# Altium schematic sheet 05-Power.SchDoc: Power supplies
size A3; Date: 01/01/2016; Author: Frédéric Renet; Organization: APTUSTECH; Address2: 8 Rue Esperandieu; Address3: 13004 Marseille; Address4: FRANCE; DocumentNumber: 123; Revision: 1.0; SheetNumber: 6; SheetTotal: 6
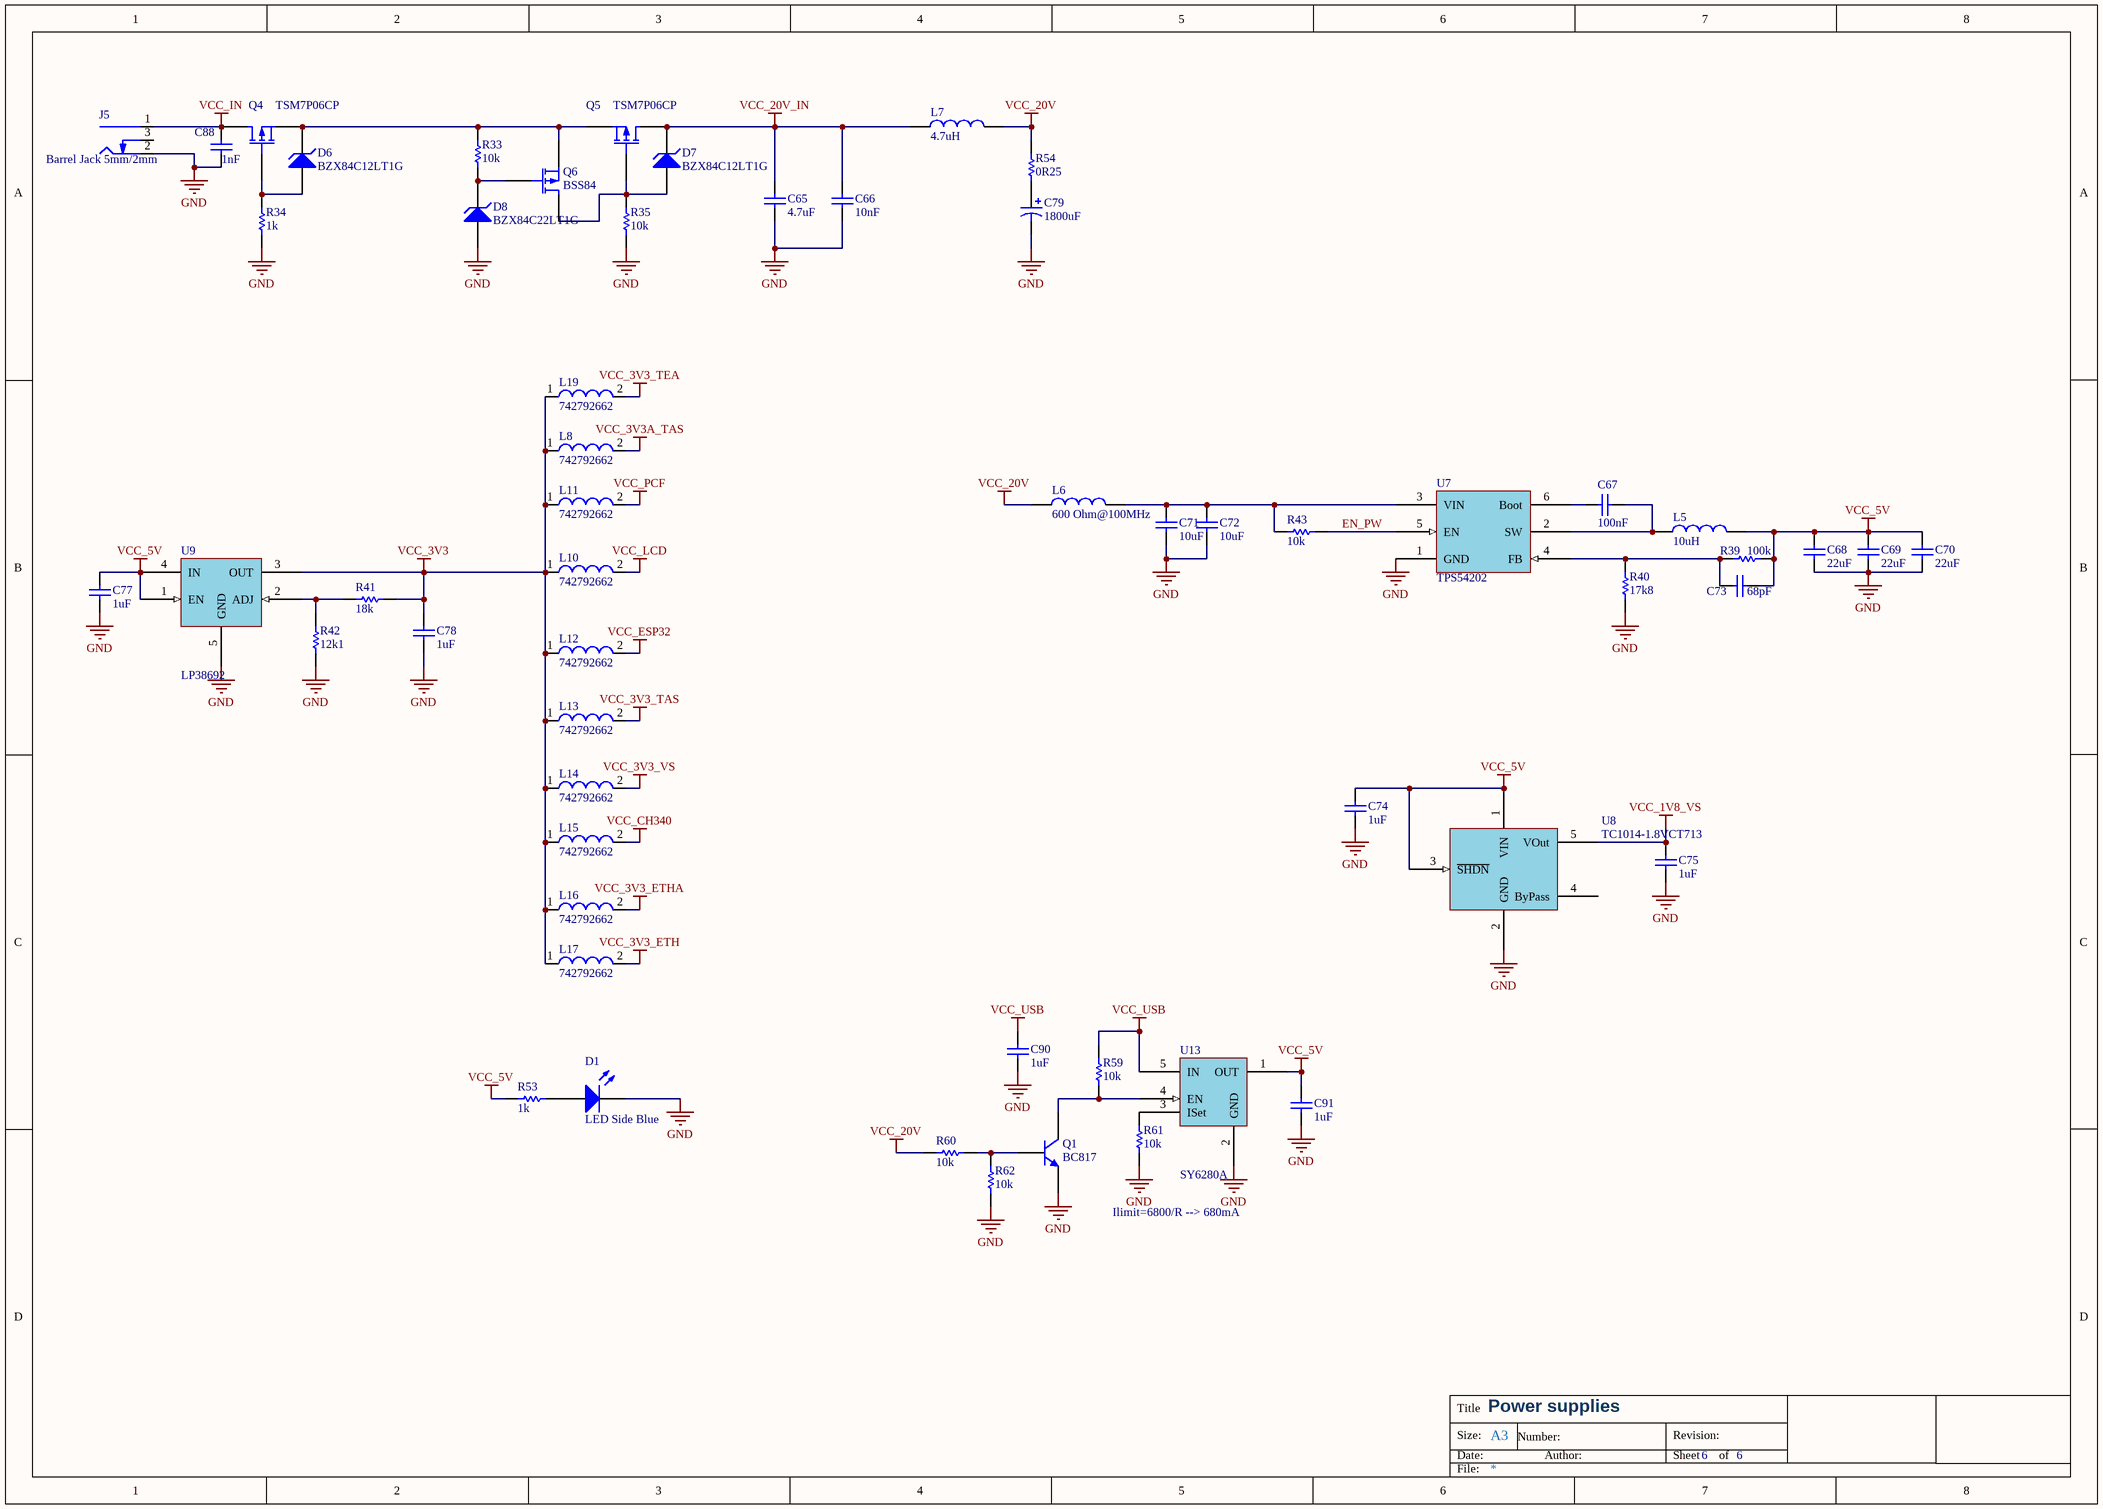
[diagram p0: 05-Power.SchDoc]

## Parts
C65  value 4.7uF  [CAPC3216X16N]  (hidden comment: 4.7uF 50V 1206 X5R)
C66  value 10nF  [CAPC1608X06N]  (hidden comment: 10nF 50V 0603 NP0)
C67  value 100nF  [CAPC2012X14N]  (hidden comment: 100nfF 10V 0805 X5R)
C68  value 22uF  [CAPC2012X14N]  (hidden comment: 22uF 10V 0805 X5R)
C69  value 22uF  [CAPC2012X14N]  (hidden comment: 22uF 10V 0805 X5R)
C70  value 22uF  [CAPC2012X14N]  (hidden comment: 22uF 10V 0805 X5R)
C71  value 10uF  [CAPC3216X16N]  (hidden comment: 10uF 50V 1206 X5R)
C72  value 10uF  [CAPC3216X16N]  (hidden comment: 10uF 50V 1206 X5R)
C73  value 68pF  [CAPC1608X06N]  (hidden comment: 68pF 50V 0603 NP0)
C74  value 1uF  [CAPC1608X06N]  (hidden comment: 1uF 16V 0603 X7R)
C75  value 1uF  [CAPC1608X06N]  (hidden comment: 1uF 16V 0603 X7R)
C77  value 1uF  [CAPC1608X06N]  (hidden comment: 1uF 16V 0603 X7R)
C78  value 1uF  [CAPC1608X06N]  (hidden comment: 1uF 16V 0603 X7R)
C79  value 1800uF  [Cap_POL_12.5mm_20mm_TH]  (hidden comment: 1800uF 25V)
C88  value 1nF  [CAPC3216X16N]  (hidden comment: 1nF 100V 1206 X7R)
C90  value 1uF  [CAPC1608X06N]  (hidden comment: 1uF 16V 0603 X7R)
C91  value 1uF  [CAPC1608X06N]  (hidden comment: 1uF 16V 0603 X7R)
D1  LED Side Blue  [APA1606]
D6  BZX84C12LT1G  [SOT95P230X110-3N]
D7  BZX84C12LT1G  [SOT95P230X110-3N]
D8  BZX84C22LT1G  [SOT95P230X110-3N]
J5  Barrel Jack 5mm/2mm  [CUI PJ-102AH]
L5  value 10uH  [SRN6045]  (hidden comment: SRN6045-100M)
L6  value 600 Ohm@100MHz  [IND2012X14N]  (hidden comment: 74279220601)
L7  value 4.7uH  [1255AY]  (hidden comment: 1255AY-4R7M=P3)
L8  742792662  [CAPC0603(1608)]
L10  742792662  [CAPC0603(1608)]
L11  742792662  [CAPC0603(1608)]
L12  742792662  [CAPC0603(1608)]
L13  742792662  [CAPC0603(1608)]
L14  742792662  [CAPC0603(1608)]
L15  742792662  [CAPC0603(1608)]
L16  742792662  [CAPC0603(1608)]
L17  742792662  [CAPC0603(1608)]
L19  742792662  [CAPC0603(1608)]
Q1  BC817  [SOT95P230X110-3N]
Q4  TSM7P06CP  [TO252]
Q5  TSM7P06CP  [TO252]
Q6  BSS84  [SOT95P230X110-3N]
R33  value 10k  [RESC1608X06N]  (hidden comment: 10k_0603)
R34  value 1k  [RESC1608X06N]  (hidden comment: 1k_0603)
R35  value 10k  [RESC1608X06N]  (hidden comment: 10k_0603)
R39  value 100k  [RESC1608X06N]  (hidden comment: 100k_0603)
R40  value 17k8  [RESC1608X06N]  (hidden comment: 17k8_0603)
R41  value 18k  [RESC1608X06N]  (hidden comment: 18k_0603)
R42  value 12k1  [RESC1608X06N]  (hidden comment: 12k1_0603)
R43  value 10k  [RESC1608X06N]  (hidden comment: 10k_0603)
R53  value 1k  [RESC1608X06N]  (hidden comment: 1k_0603)
R54  value 0R25  [RESC3116X07N]  (hidden comment: 0R25_1206)
R59  value 10k  [RESC1608X06N]  (hidden comment: 10k_0603)
R60  value 10k  [RESC1608X06N]  (hidden comment: 10k_0603)
R61  value 10k  [RESC1608X06N]  (hidden comment: 10k_0603)
R62  value 10k  [RESC1608X06N]  (hidden comment: 10k_0603)
U7  TPS54202  [SOT95P245X110-6N]
U8  TC1014-1.8VCT713  [SOT95P245X110-5N]
U9  LP38692  [SOT150P700X180-5N]
U13  SY6280A  [SOT95P245X110-5N]

## Nets
GND: C65.1 C66.1 C68.1 C69.1 C70.1 C71.1 C72.1 C74.1 C75.1 C77.1 C78.1 C79.2 C88.1 C90.1 C91.1 D1.1(K) D8.1(A) J5.2(Outer) Q1.2(E) R34.1 R35.1 R40.1 R42.1 R61.1 R62.2 U7.1(GND) U8.2(GND) U9.5(GND) U13.2(GND)
VCC_1V8_VS: C75.2 U8.5(VOut)
VCC_3V3: C78.2 L8.1 L10.1 L11.1 L12.1 L13.1 L14.1 L15.1 L16.1 L17.1 L19.1 R41.2 U9.3(OUT)
VCC_3V3_ETH: L17.2
VCC_3V3_ETHA: L16.2
VCC_3V3_TAS: L13.2
VCC_3V3_TEA: L19.2
VCC_3V3_VS: L14.2
VCC_3V3A_TAS: L8.2
VCC_5V: C68.2 C69.2 C70.2 C73.2 C74.2 C77.2 C91.2 L5.2 R39.2 R53.2 U8.1(VIN) U8.3(~{SHDN}) U9.1(EN) U9.4(IN) U13.1(OUT)
VCC_20V: L6.1 L7.2 R54.2 R60.2
VCC_20V_IN: C65.2 C66.2 D7.3(K) L7.1 Q5.2(D)
VCC_CH340: L15.2
VCC_ESP32: L12.2
VCC_IN: C88.2 J5.1(Centre) Q4.2(D)
VCC_LCD: L10.2
VCC_PCF: L11.2
VCC_USB: C90.2 R59.2 U13.5(IN)
EN_PW: R43.1 U7.5(EN)
NetC67_1: C67.1 U7.6(Boot)
NetC67_2: C67.2 L5.1 U7.2(SW)
NetC71_2: C71.2 C72.2 L6.2 R43.2 U7.3(VIN)
NetC73_1: C73.1 R39.1 R40.2 U7.4(FB)
NetC79_1: C79.1 R54.1
NetD1_2: D1.2(A) R53.1
NetD6_1: D6.1(A) Q4.1(G) R34.2
NetD6_3: D6.3(K) Q4.3(S) Q5.3(S) Q6.2(S) R33.2
NetD7_1: D7.1(A) Q5.1(G) Q6.3(D) R35.2
NetD8_3: D8.3(K) Q6.1(G) R33.1
NetQ1_1: Q1.1(B) R60.1 R62.1
NetQ1_3: Q1.3(C) R59.1 U13.4(EN)
NetR41_1: R41.1 R42.2 U9.2(ADJ)
NetR61_2: R61.2 U13.3(ISet)

Not connected (* = marked no-connect by the designer): J5 3(SW); U8 4(ByPass)

## Notes on the sheet
- Ilimit=6800/R --> 680mA
- Title
- Size:
- Date:
- A3
- Number:
- Author:
- Revision:
- Sheet
- of
- File:

## Library data of the parts
C65 = 4.7uF 50V 1206 X5R: Tolerance: 10%; Voltage: 50V; Supplier1: Digikey; Supplier2: Mouser; Supplier3: Farnell; RefSupplier1: 587-2994-1-ND; RefSupplier2: *; RefSupplier3: *; Case: 1206; Material: X5R
C66 = 10nF 50V 0603 NP0: Tolerance: 10%; Voltage: 50V; Supplier1: Digikey; Supplier2: Mouser; Supplier3: Farnell; RefSupplier1: 490-9666-1-ND; RefSupplier2: *; RefSupplier3: *; Case: 0603; Material: NP0
C67 = 100nF 50V 0805 X5R_1: 100nF 50V 0805 X5R; Tolerance: 10%; Voltage: 50V; Supplier1: Digikey; Supplier2: Mouser; Supplier3: Farnell; RefSupplier2: *; RefSupplier3: *; Case: 0805; Material: X5R
C68-C70 = 22uF 10V 0805 X5R: Tolerance: 10%; Voltage: 10V; Supplier1: Digikey; Supplier2: Mouser; Supplier3: Farnell; RefSupplier1: 490-10511-1-ND; RefSupplier2: *; RefSupplier3: *; Case: 0805; Material: X5R
C71 C72 = 10uF 50V 1206 X5R: Tolerance: 10%; Voltage: 50V; Supplier1: Digikey; Supplier2: Mouser; Supplier3: Farnell; RefSupplier1: 1276-6736-1-ND; RefSupplier2: *; RefSupplier3: *; Case: 1206; Material: X5R
C73 = 68pF 50V 0603 NP0: Tolerance: 10%; Voltage: 50V; Supplier1: Digikey; Supplier2: Mouser; Supplier3: Farnell; RefSupplier1: 490-11301-1-ND; RefSupplier2: *; RefSupplier3: *; Case: 0603; Material: NP0
C74 C75 C77 C78 C90 C91 = 1uF 16V 0603 X7R: Tolerance: 10%; Voltage: 16V; Supplier1: Digikey; Supplier2: Mouser; Supplier3: Farnell; RefSupplier1: EMK107B7105KA-T; RefSupplier2: *; RefSupplier3: *; Case: 0603; Material: X7R
C79 = 1800uF 25V 12.5mm 20mm: Aluminum Capacitor 1800uF 25V TH 12.5mm 20mm; PartNumber: EGXF250ELL182MK20S; Manufacturer: United Chemi-Con; Tolerance: 20%; Voltage: 25V; Supplier1: Mouser; RefSupplier1: 661-EGXF250ELL182MK2
C88 = 1nF 100V 1206 X7R: Tolerance: 10%; Voltage: 100V; Supplier1: Digikey; Supplier2: Mouser; Supplier3: Farnell; RefSupplier2: 77-VJ1206Y102JXBAC; RefSupplier3: *; Case: 1206; Material: X7R
D1 = LED Side Blue: Side Emitting LED Blue; Manufacturer: Kingbtigth; PartNumber: APA1606QBC/D
D6 D7 = BZX84C12LT1G: DIODE ZENER 12V 250MW SOT23-3; Manufacturer: ON Semi; Supplier1: Digikey; PartNumber: BZX84C12LT1G; RefSupplier1: BZX84C12LT1GOSCT-ND; Case: SOT23
D8 = BZX84C22LT1G: DIODE ZENER 22V 250MW SOT23-3; Manufacturer: ON Semi; Supplier1: Digikey; PartNumber: BZX84C22LT1G; RefSupplier1: BZX84C22LT1GOSTR-ND; Case: SOT23
J5 = Barrel Connector: CONN PWR JACK 2X5.5MM SOLDER; PartNumber: PJ-102AH; Manufacturer: CUI; Supplier1: Digikey; RefSupplier1: CP-102AH-ND
L5 = SRN6045-100M: SRN6045-100M 10uH 2.5A 6x6x4,5mm; Manufacturer: Bourns; PartNumber: SRN6045-100M; Rated Current: 2.5A; Case: 6045; Supplier1: Digikey; Supplier2: Mouser; Supplier3: Farnell; RefSupplier2: *; RefSupplier3: *
L6 = 74279220601: 0805, 600 Ohm@100MHz, 2.1A; Manufacturer: Wurth; PartNumber: 74279220601; Size: 0805; Supplier1: Digikey; RefSupplier1: 732-6126-1-ND
L7 = 1255AY-4R7M=P3: 1255AY-4R7M=P3 4.7uH 4A; Manufacturer: Murata; PartNumber: 1255AY-4R7M=P3; Rated Current: 4A; Case: 2424; Supplier1: Digikey; Supplier2: Mouser; Supplier3: Farnell; RefSupplier2: *; RefSupplier3: *
L8 L10-L17 L19 = CMP-0220-00178-1: SMD EMI Suppression Ferrite Bead WE-CBF, Z = 1000 Ohm; Manufacturer: Wurth; PackageDescription: Chip Inductor, 2-Leads, Body 1.6 x 0.8 mm; PackageVersion: 2009; PackageReference: SMD-0603; ComponentLink1URL: http://www.we-online.com; ComponentLink2URL: http://www.we-online.de/katalog/media/pdf/742792662.pdf; Impedance: 1000 Ohm; DatasheetVersion: ver 1, Mar-2010; ComponentLink1Description: Manufacturer Link; ComponentLink2Description: Datasheet; PartNumber: 742792662
Q1 = BC817_SOT23: BC817 NPN  45V SOT23; PartNumber: BC817-40,215; Manufacturer: Nexperia; Case: SOT23; Supplier1: Digikey; RefSupplier1: 1727-2919-1-ND
Q4 Q5 = TSM7P06CP: MOSFET P-CHANNEL 60V 7A TO252; Manufacturer: Taiwan Semiconductor Corp; PartNumber: TSM7P06CP; Supplier1: Digikey; RefSupplier1: TSM7P06CP ROGCT-ND
Q6 = BSS84: MOSFET P-CH 60V 170MA SOT-23; PartNumber: BSS84PH6433XTMA1; Manufacturer: Infineon; Supplier1: Digikey; RefSupplier1: BSS84PH6433XTMA1TR-ND
R33 R35 R43 R59-R62 = 10k: Resistor 10k 0603 1%; Case: 0603; Tolerance: 1%; Size: 0603, 1.6x0.8x0.8mm; RefSupplier1: 311-10.0KHRCT-ND; RefSupplier2: *; RefSupplier3: *; Supplier1: Digikey; Supplier2: *; Supplier3: *
R34 R53 = 1k: Resistor 1k 0603 1%; Case: 0603; Tolerance: 1%; Size: 0603, 1.6x0.8x0.8mm; Supplier1: Digikey; Supplier2: Mouser; Supplier3: Farnell; RefSupplier1: 311-1.00KHRCT-ND; RefSupplier2: *; RefSupplier3: *
R39 = 100k: Resistor 100k 0603 1%; Case: 0603; Tolerance: 1%; Supplier1: Digikey; Supplier2: *; Supplier3: *; RefSupplier1: 311-100KHRCT-ND; RefSupplier2: *; RefSupplier3: *
R40 = 17k8: Resistor 17k8 0603 1%; Case: 0603; Tolerance: 1%; Supplier1: Digikey; Supplier2: *; Supplier3: *; RefSupplier1: 311-17.8KHRTR-ND; RefSupplier2: *; RefSupplier3: *
R41 = 18k: Resistor 18k 0603 1%; Case: 0603; Tolerance: 1%; Size: 0603, 1.6x0.8x0.8mm; RefSupplier1: 311-18.0KHRCT-ND; RefSupplier2: *; RefSupplier3: *; Supplier1: Digikey; Supplier2: *; Supplier3: *
R42 = 12k1: Resistor 12k1 0603 1%; Case: 0603; Tolerance: 1%; Size: 0603, 1.6x0.8x0.8mm; RefSupplier1: 311-12.1KHRCT-ND; RefSupplier2: *; RefSupplier3: *; Supplier1: Digikey; Supplier2: *; Supplier3: *
R54 = 0R25_1206: Resistor 0.25R 1206 1%; Case: 1206; Tolerance: 1%; Size: 1206, 3.2x1.6x0.8mm; Supplier1: Digikey; Supplier2: Mouser; Supplier3: Farnell; RefSupplier2: 603-PT1206FR-070R25L; RefSupplier3: *
U7 = TPS54202: 4.5V to 28V Input, 2A Output Sync Buck; PartNumber: TPS54202DDC; Manufacturer: TI; Case: SOT23-6
U8 = TC1014-1.8VCT713: 1.8V LDO 50mA SOT23-5; Manufacturer: Microchip; PartNumber: TC1014-1.8VCT713; Case: SOT23-5
U9 = LP38692MP-ADJ/NOPB: REG LIN POS ADJ 1A SOT223-5 LP38692MP-ADJ/NOPB; Manufacturer: TI; PartNumber: LP38692MP-ADJ/NOPB; Case: SOT223-5
U13 = SY6280A: SOT23-5 USB VCC Switch with current Limit; Manufacturer: Silergy; PartNumber: SY6280A; Case: SOT23-5